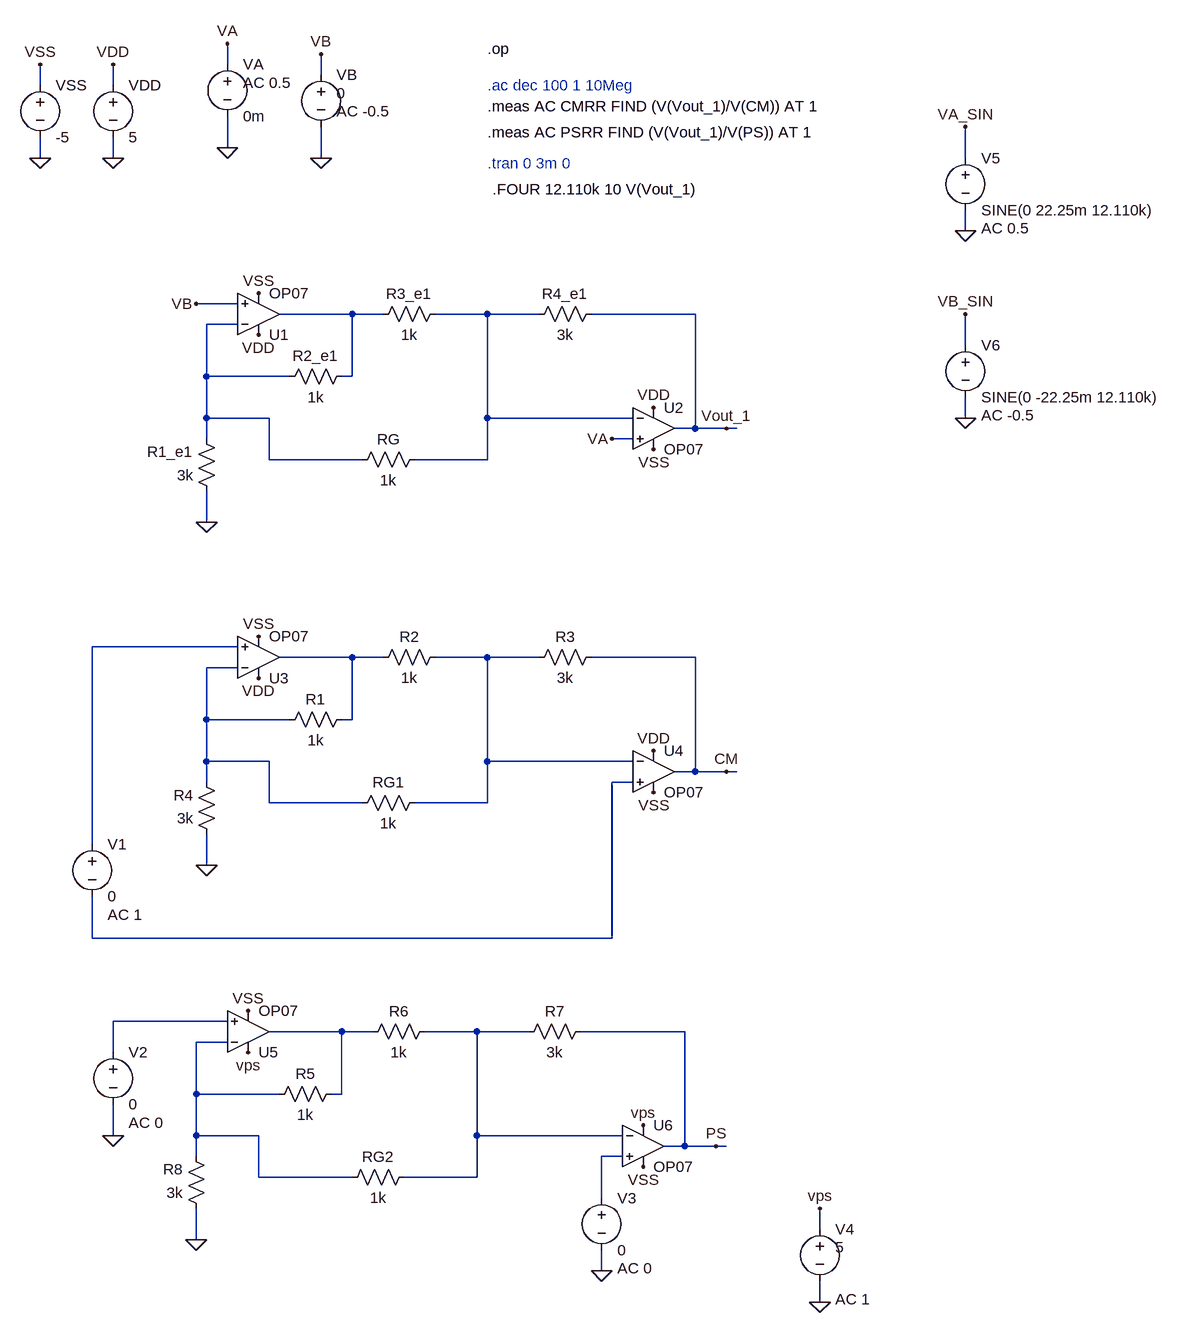
[diagram p0: schematic etajul1.asc]
etajul1.asc, the LTspice schematic file:
Version 4
SHEET 1 1604 1716
WIRE 144 -208 144 -240
WIRE 288 -192 288 -224
WIRE -144 -176 -144 -208
WIRE -32 -176 -32 -208
WIRE 144 -80 144 -128
WIRE -144 -64 -144 -96
WIRE -32 -64 -32 -96
WIRE 288 -64 288 -112
WIRE 1280 -64 1280 -112
WIRE 1280 48 1280 16
WIRE 160 160 96 160
WIRE 336 176 224 176
WIRE 384 176 336 176
WIRE 544 176 464 176
WIRE 624 176 544 176
WIRE 864 176 704 176
WIRE 160 192 112 192
WIRE 1280 224 1280 176
WIRE 112 272 112 192
WIRE 240 272 112 272
WIRE 336 272 336 176
WIRE 336 272 320 272
WIRE 112 336 112 272
WIRE 208 336 112 336
WIRE 544 336 544 176
WIRE 768 336 544 336
WIRE 1280 336 1280 304
WIRE 864 352 864 176
WIRE 864 352 832 352
WIRE 912 352 864 352
WIRE 928 352 912 352
WIRE 112 368 112 336
WIRE 768 368 736 368
WIRE 208 400 208 336
WIRE 352 400 208 400
WIRE 544 400 544 336
WIRE 544 400 432 400
WIRE 112 496 112 448
WIRE 160 688 -64 688
WIRE 336 704 224 704
WIRE 384 704 336 704
WIRE 544 704 464 704
WIRE 624 704 544 704
WIRE 864 704 704 704
WIRE 160 720 112 720
WIRE 112 800 112 720
WIRE 240 800 112 800
WIRE 336 800 336 704
WIRE 336 800 320 800
WIRE 112 864 112 800
WIRE 208 864 112 864
WIRE 544 864 544 704
WIRE 768 864 544 864
WIRE 864 880 864 704
WIRE 864 880 832 880
WIRE 912 880 864 880
WIRE 928 880 912 880
WIRE 112 896 112 864
WIRE 768 896 736 896
WIRE 208 928 208 864
WIRE 352 928 208 928
WIRE 544 928 544 864
WIRE 544 928 432 928
WIRE -64 992 -64 688
WIRE 112 1024 112 976
WIRE -64 1136 -64 1072
WIRE 736 1136 736 896
WIRE 736 1136 -64 1136
WIRE 144 1264 -32 1264
WIRE 320 1280 208 1280
WIRE 368 1280 320 1280
WIRE 528 1280 448 1280
WIRE 608 1280 528 1280
WIRE 848 1280 688 1280
WIRE 144 1296 96 1296
WIRE -32 1312 -32 1264
WIRE 96 1376 96 1296
WIRE 224 1376 96 1376
WIRE 320 1376 320 1280
WIRE 320 1376 304 1376
WIRE -32 1440 -32 1392
WIRE 96 1440 96 1376
WIRE 192 1440 96 1440
WIRE 528 1440 528 1280
WIRE 752 1440 528 1440
WIRE 848 1456 848 1280
WIRE 848 1456 816 1456
WIRE 896 1456 848 1456
WIRE 912 1456 896 1456
WIRE 96 1472 96 1440
WIRE 752 1472 720 1472
WIRE 192 1504 192 1440
WIRE 336 1504 192 1504
WIRE 528 1504 528 1440
WIRE 528 1504 416 1504
WIRE 720 1536 720 1472
WIRE 1056 1584 1056 1552
WIRE 96 1600 96 1552
WIRE 720 1648 720 1616
WIRE 1056 1696 1056 1664
FLAG 96 160 VB
FLAG 112 496 0
FLAG 736 368 VA
FLAG -144 -64 0
FLAG -32 -64 0
FLAG -144 -208 VSS
FLAG -32 -208 VDD
FLAG 192 144 VSS
FLAG 800 384 VSS
FLAG 800 320 VDD
FLAG 192 208 VDD
FLAG 912 352 Vout_1
FLAG 144 -240 VA
FLAG 288 -224 VB
FLAG 144 -80 0
FLAG 288 -64 0
FLAG 112 1024 0
FLAG 192 672 VSS
FLAG 800 912 VSS
FLAG 800 848 VDD
FLAG 192 736 VDD
FLAG 912 880 CM
FLAG 96 1600 0
FLAG 176 1248 VSS
FLAG 784 1488 VSS
FLAG 896 1456 PS
FLAG -32 1440 0
FLAG 720 1648 0
FLAG 1056 1696 0
FLAG 1056 1552 vps
FLAG 176 1312 vps
FLAG 784 1424 vps
FLAG 1280 -112 VA_SIN
FLAG 1280 176 VB_SIN
FLAG 1280 48 0
FLAG 1280 336 0
SYMBOL OpAmps\\OP07 192 240 M180
SYMATTR InstName U1
SYMBOL res 336 256 R90
WINDOW 0 0 56 VBottom 2
WINDOW 3 32 56 VTop 2
SYMATTR InstName R2_e1
SYMATTR Value 1k
SYMBOL res 480 160 R90
WINDOW 0 0 56 VBottom 2
WINDOW 3 32 56 VTop 2
SYMATTR InstName R3_e1
SYMATTR Value 1k
SYMBOL res 720 160 R90
WINDOW 0 0 56 VBottom 2
WINDOW 3 32 56 VTop 2
SYMATTR InstName R4_e1
SYMATTR Value 3k
SYMBOL res 128 464 R180
WINDOW 0 36 76 Left 2
WINDOW 3 36 40 Left 2
SYMATTR InstName R1_e1
SYMATTR Value 3k
SYMBOL OpAmps\\OP07 800 288 R0
SYMATTR InstName U2
SYMBOL res 448 384 R90
WINDOW 0 0 56 VBottom 2
WINDOW 3 32 56 VTop 2
SYMATTR InstName RG
SYMATTR Value 1k
SYMBOL voltage -144 -192 R0
SYMATTR InstName VSS
SYMATTR Value -5
SYMBOL voltage -32 -192 R0
SYMATTR InstName VDD
SYMATTR Value 5
SYMBOL voltage 144 -224 R0
WINDOW 123 24 44 Left 2
WINDOW 39 0 0 Left 0
SYMATTR Value2 AC 0.5
SYMATTR InstName VA
SYMATTR Value 0m
SYMBOL voltage 288 -208 R0
WINDOW 3 24 44 Left 2
WINDOW 123 24 72 Left 2
WINDOW 39 0 0 Left 0
SYMATTR Value 0
SYMATTR Value2 AC -0.5
SYMATTR InstName VB
SYMBOL OpAmps\\OP07 192 768 M180
SYMATTR InstName U3
SYMBOL res 336 784 R90
WINDOW 0 0 56 VBottom 2
WINDOW 3 32 56 VTop 2
SYMATTR InstName R1
SYMATTR Value 1k
SYMBOL res 480 688 R90
WINDOW 0 0 56 VBottom 2
WINDOW 3 32 56 VTop 2
SYMATTR InstName R2
SYMATTR Value 1k
SYMBOL res 720 688 R90
WINDOW 0 0 56 VBottom 2
WINDOW 3 32 56 VTop 2
SYMATTR InstName R3
SYMATTR Value 3k
SYMBOL res 128 992 R180
WINDOW 0 36 76 Left 2
WINDOW 3 36 40 Left 2
SYMATTR InstName R4
SYMATTR Value 3k
SYMBOL OpAmps\\OP07 800 816 R0
SYMATTR InstName U4
SYMBOL res 448 912 R90
WINDOW 0 0 56 VBottom 2
WINDOW 3 32 56 VTop 2
SYMATTR InstName RG1
SYMATTR Value 1k
SYMBOL voltage -64 976 R0
WINDOW 123 24 124 Left 2
WINDOW 39 0 0 Left 0
SYMATTR Value2 AC 1
SYMATTR InstName V1
SYMATTR Value 0
SYMBOL OpAmps\\OP07 176 1344 M180
SYMATTR InstName U5
SYMBOL res 320 1360 R90
WINDOW 0 0 56 VBottom 2
WINDOW 3 32 56 VTop 2
SYMATTR InstName R5
SYMATTR Value 1k
SYMBOL res 464 1264 R90
WINDOW 0 0 56 VBottom 2
WINDOW 3 32 56 VTop 2
SYMATTR InstName R6
SYMATTR Value 1k
SYMBOL res 704 1264 R90
WINDOW 0 0 56 VBottom 2
WINDOW 3 32 56 VTop 2
SYMATTR InstName R7
SYMATTR Value 3k
SYMBOL res 112 1568 R180
WINDOW 0 36 76 Left 2
WINDOW 3 36 40 Left 2
SYMATTR InstName R8
SYMATTR Value 3k
SYMBOL OpAmps\\OP07 784 1392 R0
SYMATTR InstName U6
SYMBOL res 432 1488 R90
WINDOW 0 0 56 VBottom 2
WINDOW 3 32 56 VTop 2
SYMATTR InstName RG2
SYMATTR Value 1k
SYMBOL voltage -32 1296 R0
WINDOW 123 24 124 Left 2
WINDOW 39 0 0 Left 0
SYMATTR Value2 AC 0
SYMATTR InstName V2
SYMATTR Value 0
SYMBOL voltage 720 1520 R0
WINDOW 123 24 124 Left 2
WINDOW 39 0 0 Left 0
SYMATTR Value2 AC 0
SYMATTR InstName V3
SYMATTR Value 0
SYMBOL voltage 1056 1568 R0
WINDOW 123 24 124 Left 2
WINDOW 39 0 0 Left 0
WINDOW 3 24 44 Left 2
SYMATTR Value2 AC 1
SYMATTR Value 5
SYMATTR InstName V4
SYMBOL voltage 1280 -80 R0
WINDOW 123 24 124 Left 2
WINDOW 39 0 0 Left 0
SYMATTR Value2 AC 0.5
SYMATTR InstName V5
SYMATTR Value SINE(0 22.25m 12.110k)
SYMBOL voltage 1280 208 R0
WINDOW 123 24 124 Left 2
WINDOW 39 0 0 Left 0
SYMATTR Value2 AC -0.5
SYMATTR InstName V6
SYMATTR Value SINE(0 -22.25m 12.110k)
TEXT 544 -232 Left 2 !.op
TEXT 544 -176 Left 2 ;.ac dec 100 1 10Meg
TEXT 544 -144 Left 2 !.meas AC CMRR FIND (V(Vout_1)/V(CM)) AT 1
TEXT 544 -104 Left 2 !.meas AC PSRR FIND (V(Vout_1)/V(PS)) AT 1
TEXT 544 -56 Left 2 ;.tran 0 3m 0
TEXT 552 -16 Left 2 !.FOUR 12.110k 10 V(Vout_1)

The netlist it stands for:
* etajul1.asc
XU1 VB N003 VDD VSS N001 LT1001  ; OP07, pins In+ In- V+ V- OUT
R2_e1 N001 N003 1k
R3_e1 N002 N001 1k
R4_e1 Vout_1 N002 3k
R1_e1 0 N003 3k
XU2 VA N002 VDD VSS Vout_1 LT1001  ; OP07, pins In+ In- V+ V- OUT
RG N002 N003 1k
VSS VSS 0 -5
VDD VDD 0 5
VA VA 0 0m AC 0.5
VB VB 0 0 AC -0.5
XU3 N004 N007 VDD VSS N005 LT1001  ; OP07, pins In+ In- V+ V- OUT
R1 N005 N007 1k
R2 N006 N005 1k
R3 CM N006 3k
R4 0 N007 3k
XU4 N008 N006 VDD VSS CM LT1001  ; OP07, pins In+ In- V+ V- OUT
RG1 N006 N007 1k
V1 N004 N008 0 AC 1
XU5 N009 N012 vps VSS N010 LT1001  ; OP07, pins In+ In- V+ V- OUT
R5 N010 N012 1k
R6 N011 N010 1k
R7 PS N011 3k
R8 0 N012 3k
XU6 N013 N011 vps VSS PS LT1001  ; OP07, pins In+ In- V+ V- OUT
RG2 N011 N012 1k
V2 N009 0 0 AC 0
V3 N013 0 0 AC 0
V4 vps 0 5 AC 1
V5 VA_SIN 0 SINE(0 22.25m 12.110k) AC 0.5
V6 VB_SIN 0 SINE(0 -22.25m 12.110k) AC -0.5
.op
* .ac dec 100 1 10Meg
.meas AC CMRR FIND (V(Vout_1)/V(CM)) AT 1
.meas AC PSRR FIND (V(Vout_1)/V(PS)) AT 1
* .tran 0 3m 0
.FOUR 12.110k 10 V(Vout_1)
.lib LTC.lib
.backanno
.end